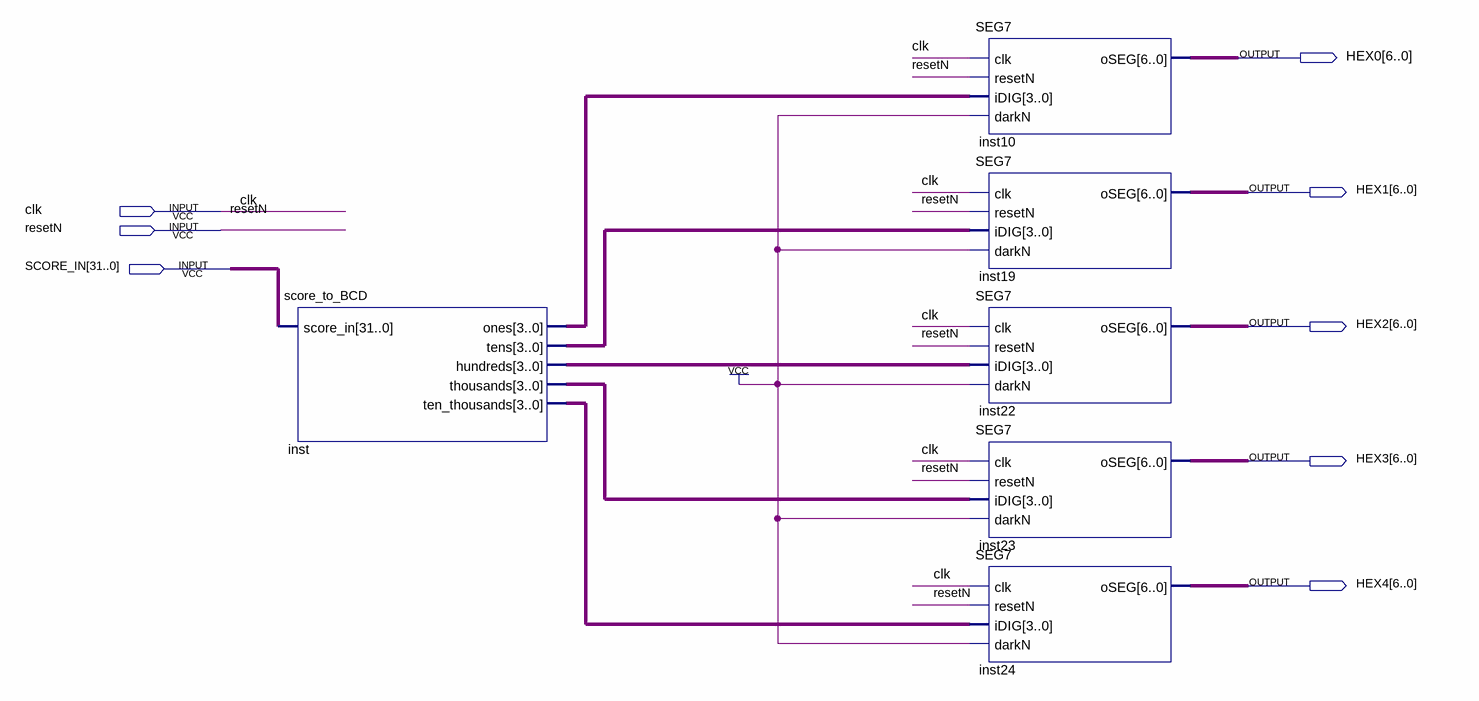
[diagram p0: schematic sheet]
// Quartus schematic ALL_HEXSS.bdf as structural Verilog: 6 symbols, 8 pins
module ALL_HEXSS (
  input  clk,
  input  resetN,
  input  [31:0] SCORE_IN,
  output [6:0] HEX0,
  output [6:0] HEX1,
  output [6:0] HEX2,
  output [6:0] HEX3,
  output [6:0] HEX4
);

  wire [3:0] inst_hundreds, inst_ones, inst_ten_thousands, inst_tens, inst_thousands;

  score_to_BCD inst (
    .score_in(SCORE_IN), .ones(inst_ones), .tens(inst_tens), .hundreds(inst_hundreds),
    .thousands(inst_thousands), .ten_thousands(inst_ten_thousands));
  SEG7 inst10 (.clk(clk), .resetN(resetN), .iDIG(inst_ones), .darkN(1'b1), .oSEG(HEX0));
  SEG7 inst19 (.clk(clk), .resetN(resetN), .iDIG(inst_tens), .darkN(1'b1), .oSEG(HEX1));
  SEG7 inst22 (.clk(clk), .resetN(resetN), .iDIG(inst_hundreds), .darkN(1'b1), .oSEG(HEX2));
  SEG7 inst23 (.clk(clk), .resetN(resetN), .iDIG(inst_thousands), .darkN(1'b1), .oSEG(HEX3));
  SEG7 inst24 (.clk(clk), .resetN(resetN), .iDIG(inst_ten_thousands), .darkN(1'b1), .oSEG(HEX4));
endmodule
